# Altium schematic sheet RTC.SchDoc
size 420 x 297 mm; SheetNumber: 19; SheetTotal: 34
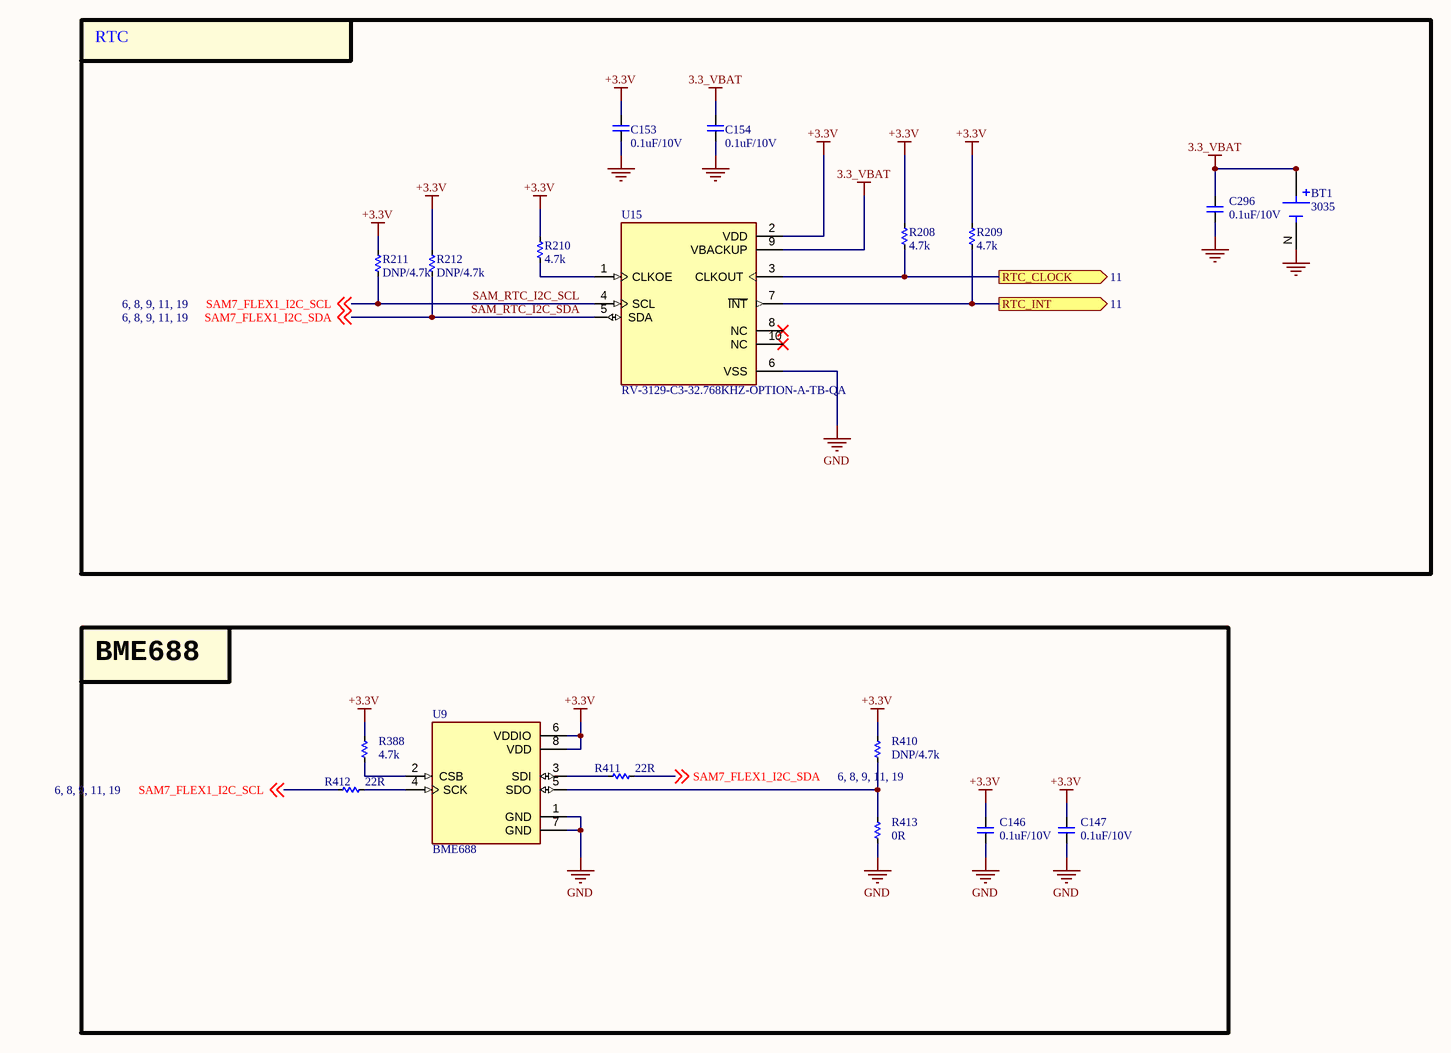
[diagram p0: RTC.SchDoc]

## Parts
BT1  3035  [BAT_3035]
C146  0.1uF/10V  [CAP_C_1005X50_L]
C147  0.1uF/10V  [CAP_C_1005X50_L]
C153  0.1uF/10V  [CAP_C_1005X50_L]
C154  0.1uF/10V  [CAP_C_1005X50_L]
C296  0.1uF/10V  [CAP_C_1005X50_L]
R208  4.7k  [RES_C_1005x30_L]
R209  4.7k  [RES_C_1005x30_L]
R210  4.7k  [RES_C_1005x30_L]
R211  DNP/4.7k  [RES_C_1005x30_L]
R212  DNP/4.7k  [RES_C_1005x30_L]
R388  4.7k  [RES_C_1005X40]
R410  DNP/4.7k  [RES_C_1005X40]
R411  22R  [RES_C_1005X40]
R412  22R  [RES_C_1005X40]
R413  0R  [RES_C_1005x30_L]
U9  BME688  [IC_BME688]
U15  RV-3129-C3-32.768KHZ-OPTION-A-TB-QA  [IC_RV-3129-C3-32.768KHZ-OPTION-A-TB-QA]

## Blocks framed on the sheet
RTC: BT1 C153 C154 C296 R208-R212 U15
BME688: C146 C147 R388 R410-R413 U9

## Ports
RTC_CLOCK (out, see 11), RTC_INT (out, see 11)

## Nets
3.3_VBAT: BT1.P1(POS) BT1.P2(POS) C154.2 C296.2 U15.9(VBACKUP)
+3.3V: C146.2 C147.2 C153.2 R208.1 R209.1 R210.1 R211.1 R212.1 R388.1 R410.1 U9.6(VDDIO) U9.8(VDD) U15.2(VDD)
GND: BT1.N(NEG) C146.1 C147.1 C153.1 C154.1 C296.1 R413.2 U9.1(GND) U9.7(GND) U15.6(VSS)
RTC_CLOCK: R208.2 U15.3(CLKOUT) ; port RTC_CLOCK
RTC_INT: R209.2 U15.7(~{INT}) ; port RTC_INT
SAM_RTC_I2C_SCL: R211.2 R412.1 U15.4(SCL) ; off-sheet SAM7_FLEX1_I2C_SCL  [also labelled SAM7_FLEX1_I2C_SCL]
SAM_RTC_I2C_SDA: R212.2 R411.2 U15.5(SDA) ; off-sheet SAM7_FLEX1_I2C_SDA  [also labelled SAM7_FLEX1_I2C_SDA]
NetR210_2: R210.2 U15.1(CLKOE)
NetR388_2: R388.2 U9.2(CSB)
NetR410_2: R410.2 R413.1 U9.5(SDO)
NetR411_1: R411.1 U9.3(SDI)
NetR412_2: R412.2 U9.4(SCK)

Not connected (* = marked no-connect by the designer): U15 8(NC)* 10(NC)*

## Notes on the sheet
- Project:
- Sub-system:
- Design by:
- Sheet title:
- Sheet
- of
- Checked by:
- Approved by:
- Revision:
- Document No:
- Size:
- Date:
- A3

## Library data of the parts
BT1 = BT_HOLDER_3035: Battery Clip; THM; 20mm Cell; PhosBronze/Nickel | Keystone Electronics 3035; SnapEDA_Link: https://www.snapeda.com/parts/3035/Keystone/view-part/?ref=snap; Package: None; Value: *; MF: Keystone Electronics; MP: 3035; Check_prices: https://www.snapeda.com/parts/3035/Keystone/view-part/?ref=eda
C146 C147 C153 C154 C296 = _CAP_C_2: CAP
R208-R212 R388 R410-R413 = _RES_B_2: RES
U9 = BME688: Gas sensor measuring relative humidity, barometric pressure, ambient temperature and gas (VOC); Package: None; MP: BME688; Price: None; Availability: Unavailable; Value: *
U15 = RV-3129-C3-32.768KHZ-OPTION-A-TB-QA: Real-Time Clock Module with I2C-Bus; MP: RV-3129-C3-32.768KHZ-OPTION-A-TB-QA; Value: *; Price: None; Package: None; Availability: Unavailable